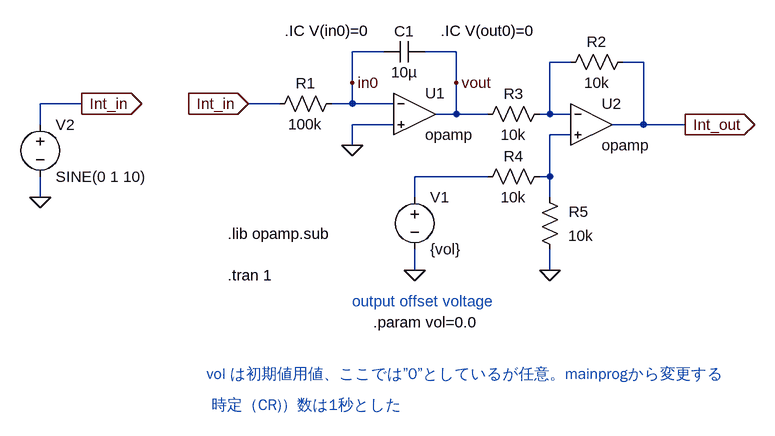
[diagram p0: schematic INT_lv2Test.asc]
INT_lv2Test.asc, the LTspice schematic file:
Version 4.1
SHEET 1 880 680
WIRE 16 -128 -32 -128
WIRE 128 -128 80 -128
WIRE 304 -112 272 -112
WIRE 416 -112 384 -112
WIRE -32 -80 -32 -128
WIRE 128 -80 128 -128
WIRE -448 -48 -512 -48
WIRE -144 -48 -192 -48
WIRE -32 -48 -32 -80
WIRE -32 -48 -64 -48
WIRE 32 -48 -32 -48
WIRE 128 -32 128 -80
WIRE 128 -32 96 -32
WIRE 176 -32 128 -32
WIRE 272 -32 272 -112
WIRE 272 -32 256 -32
WIRE 304 -32 272 -32
WIRE -512 -16 -512 -48
WIRE 32 -16 -32 -16
WIRE 416 -16 416 -112
WIRE 416 -16 368 -16
WIRE 480 -16 416 -16
WIRE 304 0 272 0
WIRE -32 16 -32 -16
WIRE 176 64 64 64
WIRE 272 64 272 0
WIRE 272 64 256 64
WIRE -512 96 -512 64
WIRE 64 96 64 64
WIRE 272 96 272 64
WIRE 64 208 64 176
WIRE 272 208 272 176
FLAG -32 16 0
FLAG -192 -48 Int_in
IOPIN -192 -48 In
FLAG 128 -80 vout
FLAG 272 208 0
FLAG 480 -16 Int_out
IOPIN 480 -16 Out
FLAG 64 208 0
FLAG -32 -80 in0
FLAG -512 96 0
FLAG -448 -48 Int_in
IOPIN -448 -48 Out
SYMBOL cap 16 -112 R270
WINDOW 0 32 32 VTop 2
WINDOW 3 0 32 VBottom 2
SYMATTR InstName C1
SYMATTR Value 10µ
SYMBOL res -48 -64 R90
WINDOW 0 0 56 VBottom 2
WINDOW 3 32 56 VTop 2
SYMATTR InstName R1
SYMATTR Value 100k
SYMBOL OpAmps\\opamp 64 -96 R0
SYMATTR InstName U1
SYMATTR SpiceLine Aol=10meg
SYMATTR SpiceLine2 GBW=1g
SYMBOL OpAmps\\opamp 336 -80 R0
SYMATTR InstName U2
SYMATTR SpiceLine Aol=10meg
SYMATTR SpiceLine2 GBW=1g
SYMBOL res 400 -128 R90
WINDOW 0 0 56 VBottom 2
WINDOW 3 32 56 VTop 2
SYMATTR InstName R2
SYMATTR Value 10k
SYMBOL res 272 -48 R90
WINDOW 0 0 56 VBottom 2
WINDOW 3 32 56 VTop 2
SYMATTR InstName R3
SYMATTR Value 10k
SYMBOL res 272 48 R90
WINDOW 0 0 56 VBottom 2
WINDOW 3 32 56 VTop 2
SYMATTR InstName R4
SYMATTR Value 10k
SYMBOL res 288 192 R180
WINDOW 0 -44 74 Left 2
WINDOW 3 -51 37 Left 2
SYMATTR InstName R5
SYMATTR Value 10k
SYMBOL voltage 64 80 R0
WINDOW 123 0 0 Left 0
WINDOW 39 0 0 Left 0
SYMATTR InstName V1
SYMATTR Value {vol}
SYMBOL voltage -512 -32 R0
WINDOW 123 0 0 Left 0
WINDOW 39 0 0 Left 0
SYMATTR InstName V2
SYMATTR Value SINE(0 1 10)
TEXT -224 152 Left 2 !.lib opamp.sub
TEXT 0 288 Left 2 !.param vol=0.0
TEXT -256 368 Left 2 ;vol は初期値用値、ここでは”0”としているが任意。mainprogから変更する
TEXT -248 416 Left 2 ;時定（CR)）数は1秒とした
TEXT -32 256 Left 2 ;output offset voltage
TEXT -136 -160 Left 2 !.IC V(in0)=0
TEXT 104 -160 Left 2 !.IC V(out0)=0
TEXT -224 216 Left 2 !.tran 1

The netlist it stands for:
* INT_lv2Test.asc
C1 in0 vout 10µ
R1 in0 Int_in 100k
X§U1 in0 0 vout opamp Aol=10meg GBW=1g  ; pins invin noninvin out
X§U2 N001 N002 Int_out opamp Aol=10meg GBW=1g  ; pins invin noninvin out
R2 Int_out N001 10k
R3 N001 vout 10k
R4 N002 N003 10k
R5 0 N002 10k
V1 N003 0 {vol}
V2 Int_in 0 SINE(0 1 10)
.lib opamp.sub
.param vol=0.0
* vol は初期値用値、ここでは”0”としているが任意。mainprogから変更する
* 時定（CR)）数は1秒とした
* output offset voltage
.IC V(in0)=0
.IC V(out0)=0
.tran 1
.backanno
.end